# EAGLE design microm_schem2 (EAGLE 9.6.2)
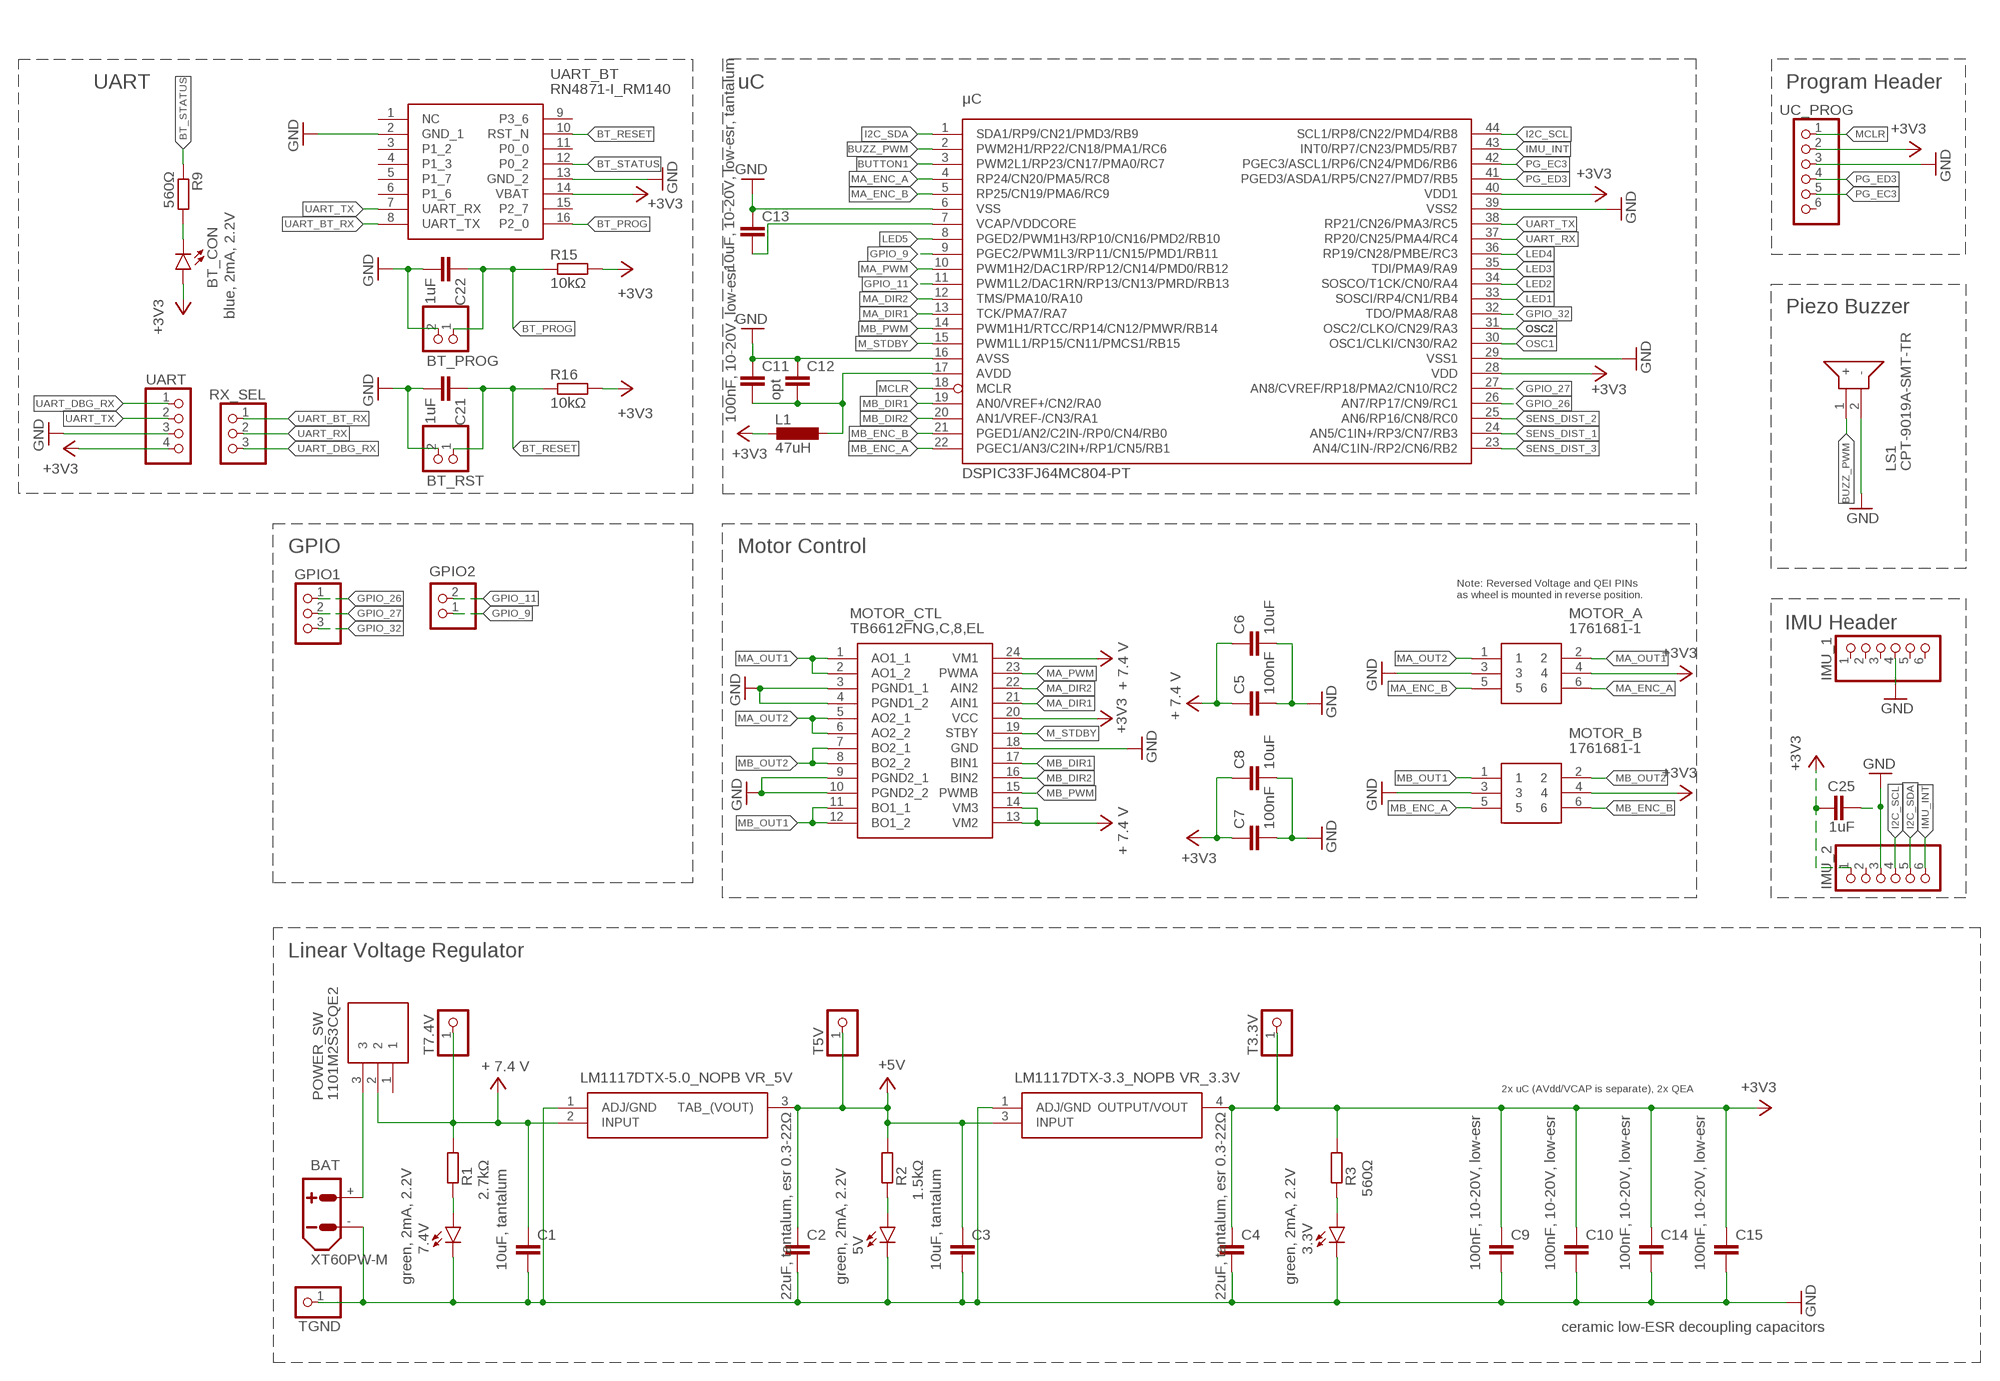
[diagram p0: schematic, sheet 1, part 1 of 2]
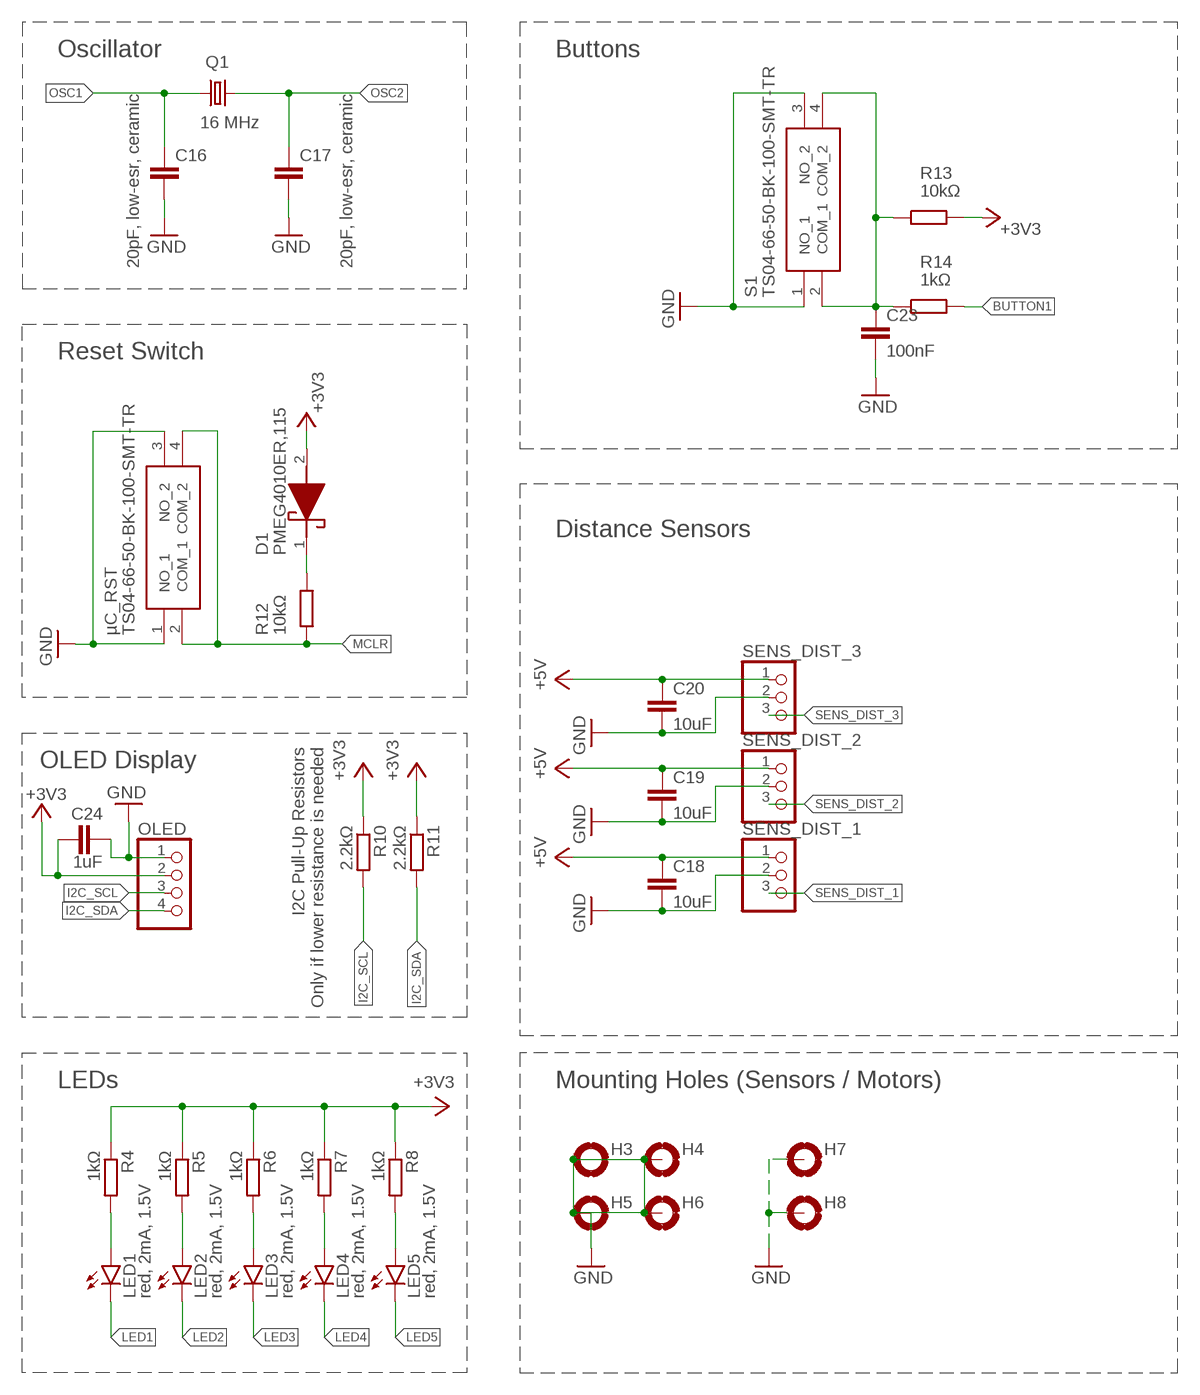
[diagram p1: schematic, sheet 1, part 2 of 2]

## Parts
3.3V  green, 2mA, 2.2V  LEDCHIP-LED0805  [CHIP-LED0805]
5V  green, 2mA, 2.2V  LEDCHIP-LED0805  [CHIP-LED0805]
7.4V  green, 2mA, 2.2V  LEDCHIP-LED0805  [CHIP-LED0805]
BAT  XT60PW-M  [XT60PW-M]
BT_CON  blue, 2mA, 2.2V  LEDCHIP-LED0805  [CHIP-LED0805]
BT_PROG  PINHD-1X2  [1X02]
BT_RST  PINHD-1X2  [1X02]
C1  10uF, tantalum  C-EUC0805  [C0805]
C2  22uF, tantalum, esr 0.3-22Ω  C-EUC0805  [C0805]
C3  10uF, tantalum  C-EUC0805  [C0805]
C4  22uF, tantalum, esr 0.3-22Ω  C-EUC0805  [C0805]
C5  100nF  C-EUC0805  [C0805]
C6  10uF  C-EUC0805  [C0805]
C7  100nF  C-EUC0805  [C0805]
C8  10uF  C-EUC0805  [C0805]
C9  100nF, 10-20V, low-esr  C-EUC0805  [C0805]
C10  100nF, 10-20V, low-esr  C-EUC0805  [C0805]
C11  100nF, 10-20V, low-esr  C-EUC0805  [C0805]
C12  opt  C-EUC0805  [C0805]
C13  10uF, 10-20V, low-esr, tantalum  C-EUC0805  [C0805]
C14  100nF, 10-20V, low-esr  C-EUC0805  [C0805]
C15  100nF, 10-20V, low-esr  C-EUC0805  [C0805]
C16  20pF, low-esr, ceramic  C-EUC0805  [C0805]
C17  20pF, low-esr, ceramic  C-EUC0805  [C0805]
C18  10uF  C-EUC0805  [C0805]
C19  10uF  C-EUC0805  [C0805]
C20  10uF  C-EUC0805  [C0805]
C21  1uF  C-EUC0805  [C0805]
C22  1uF  C-EUC0805  [C0805]
C23  100nF  C-EUC0805  [C0805]
C24  1uF  C-EUC0805  [C0805]
C25  1uF  C-EUC0805  [C0805]
D1  PMEG4010ER,115  [PMEG4010ER115]
GPIO1  PINHD-1X3  [1X03]
GPIO2  PINHD-1X2  [1X02]
H3  MOUNT-PAD-ROUND2.8  [2,8-PAD]
H4  MOUNT-PAD-ROUND2.8  [2,8-PAD]
H5  MOUNT-PAD-ROUND2.8  [2,8-PAD]
H6  MOUNT-PAD-ROUND2.8  [2,8-PAD]
H7  MOUNT-PAD-ROUND2.8  [2,8-PAD]
H8  MOUNT-PAD-ROUND2.8  [2,8-PAD]
IMU_1  PINHD-1X6  [1X06]
IMU_2  PINHD-1X6  [1X06]
L1  47uH  L-EUL1812  [L1812]
LED1  red, 2mA, 1.5V  LEDCHIPLED_0805  [CHIPLED_0805]
LED2  red, 2mA, 1.5V  LEDCHIPLED_0805  [CHIPLED_0805]
LED3  red, 2mA, 1.5V  LEDCHIPLED_0805  [CHIPLED_0805]
LED4  red, 2mA, 1.5V  LEDCHIPLED_0805  [CHIPLED_0805]
LED5  red, 2mA, 1.5V  LEDCHIPLED_0805  [CHIPLED_0805]
LS1  CPT-9019A-SMT-TR  [CPT9019ASMTTR]
MOTOR_A  1761681-1  [SHDR6W67P254_2X3_1524X916X922P]
MOTOR_B  1761681-1  [SHDR6W67P254_2X3_1524X916X922P]
MOTOR_CTL  TB6612FNG,C,8,EL  [SOP65P760X160-24N]
OLED  PINHD-1X4  [1X04]
POWER_SW  1101M2S3CQE2  [1000-SERIES(SPDT)]
Q1  16 MHz  CRYSTALHC49S  [HC49/S]
R1  2.7kΩ  R-EU_R0805  [R0805]
R2  1.5kΩ  R-EU_R0805  [R0805]
R3  560Ω  R-EU_R0805  [R0805]
R4  1kΩ  R-EU_R0805  [R0805]
R5  1kΩ  R-EU_R0805  [R0805]
R6  1kΩ  R-EU_R0805  [R0805]
R7  1kΩ  R-EU_R0805  [R0805]
R8  1kΩ  R-EU_R0805  [R0805]
R9  560Ω  R-EU_R0805  [R0805]
R10  2.2kΩ  R-EU_R0805  [R0805]
R11  2.2kΩ  R-EU_R0805  [R0805]
R12  10kΩ  R-EU_R0805  [R0805]
R13  10kΩ  R-EU_R0805  [R0805]
R14  1kΩ  R-EU_R0805  [R0805]
R15  10kΩ  R-EU_R0805  [R0805]
R16  10kΩ  R-EU_R0805  [R0805]
RX_SEL  PINHD-1X3  [1X03]
S1  TS04-66-50-BK-100-SMT-TR  [TS046650BK100SMTTR]
SENS_DIST_1  PINHD-1X3  [1X03]
SENS_DIST_2  PINHD-1X3  [1X03]
SENS_DIST_3  PINHD-1X3  [1X03]
T3.3V  PINHD-1X1  [1X01]
T5V  PINHD-1X1  [1X01]
T7.4V  PINHD-1X1  [1X01]
TGND  PINHD-1X1  [1X01]
UART  PINHD-1X4  [1X04]
UART_BT  RN4871-I_RM140  [RN4871IRM140]
UC_PROG  PINHD-1X6  [1X06]
VR_3.3V  LM1117DTX-3.3_NOPB  [LM1117DTX33NOPB]
VR_5V  LM1117DTX-5.0_NOPB  [LM78M05CDT]
µC_RST  TS04-66-50-BK-100-SMT-TR  [TS046650BK100SMTTR]
μC  DSPIC33FJ64MC804-PT  [TQFP44]

## Nets
+3V3: BT_CON.A C4.1 C7.1 C8.1 C9.1 C10.1 C14.1 C15.1 C24.1 C25.1 D1.2(A) IMU_2.1 L1.2 MOTOR_A.4 MOTOR_B.4 MOTOR_CTL.20(VCC) OLED.2 R3.1 R4.1 R5.1 R6.1 R7.1 R8.1 R10.1 R11.1 R13.2 R15.2 R16.2 T3.3V.1 UART.4 UART_BT.14(VBAT) UC_PROG.2 VR_3.3V.4(OUTPUT/VOUT) μC.28(VDD) μC.40(VDD1)
+5V: C2.1 C3.1 C18.1 C19.1 C20.1 R2.1 SENS_DIST_1.1 SENS_DIST_2.1 SENS_DIST_3.1 T5V.1 VR_3.3V.3(INPUT) VR_5V.3(TAB_(VOUT))
+7V4: C1.1 C5.1 C6.1 MOTOR_CTL.13(VM2) MOTOR_CTL.14(VM3) MOTOR_CTL.24(VM1) POWER_SW.2 R1.1 T7.4V.1 VR_5V.2(INPUT) ; supply symbol labelled + 7.4 V
BT_PROG: BT_PROG.1 C22.1 R15.1 UART_BT.16(P2_0)
BT_RESET: BT_RST.1 C21.1 R16.1 UART_BT.10(RST_N)
BT_STATUS: R9.1 UART_BT.12(P0_2)
BUTTON1: R14.2 μC.3(PWM2L1/RP23/CN17/PMA0/RC7)
BUZZ_PWM: LS1.1(+) μC.2(PWM2H1/RP22/CN18/PMA1/RC6)
GND: 3.3V.C 5V.C 7.4V.C BAT.- BT_PROG.2 BT_RST.2 C1.2 C2.2 C3.2 C4.2 C5.2 C6.2 C7.2 C8.2 C9.2 C10.2 C11.1 C12.1 C13.1 C14.2 C15.2 C16.2 C17.2 C18.2 C19.2 C20.2 C21.2 C22.2 C23.2 C24.2 C25.2 H3.B2,8(MOUNT) H4.B2,8(MOUNT) H5.B2,8(MOUNT) H6.B2,8(MOUNT) H7.B2,8(MOUNT) H8.B2,8(MOUNT) IMU_1.4 IMU_2.3 LS1.2(-) MOTOR_A.3 MOTOR_B.3 MOTOR_CTL.3(PGND1_1) MOTOR_CTL.4(PGND1_2) MOTOR_CTL.9(PGND2_1) MOTOR_CTL.10(PGND2_2) MOTOR_CTL.18(GND) OLED.1 S1.1(NO_1) S1.3(NO_2) SENS_DIST_1.2 SENS_DIST_2.2 SENS_DIST_3.2 TGND.1 UART.3 UART_BT.2(GND_1) UART_BT.13(GND_2) UC_PROG.3 VR_3.3V.1(ADJ/GND) VR_5V.1(ADJ/GND) µC_RST.1(NO_1) µC_RST.3(NO_2) μC.6(VSS) μC.16(AVSS) μC.29(VSS1) μC.39(VSS2)
GPIO_9: GPIO2.1 μC.9(PGEC2/PWM1L3/RP11/CN15/PMD1/RB11)
GPIO_11: GPIO2.2 μC.11(PWM1L2/DAC1RN/RP13/CN13/PMRD/RB13)
GPIO_26: GPIO1.1 μC.26(AN7/RP17/CN9/RC1)
GPIO_27: GPIO1.2 μC.27(AN8/CVREF/RP18/PMA2/CN10/RC2)
GPIO_32: GPIO1.3 μC.32(TDO/PMA8/RA8)
I2C_SCL: IMU_2.4 OLED.3 R10.2 μC.44(SCL1/RP8/CN22/PMD4/RB8)
I2C_SDA: IMU_2.5 OLED.4 R11.2 μC.1(SDA1/RP9/CN21/PMD3/RB9)
IMU_INT: IMU_2.6 μC.43(INT0/RP7/CN23/PMD5/RB7)
LED1: LED1.C μC.33(SOSCI/RP4/CN1/RB4)
LED2: LED2.C μC.34(SOSCO/T1CK/CN0/RA4)
LED3: LED3.C μC.35(TDI/PMA9/RA9)
LED4: LED4.C μC.36(RP19/CN28/PMBE/RC3)
LED5: LED5.C μC.8(PGED2/PWM1H3/RP10/CN16/PMD2/RB10)
M_STDBY: MOTOR_CTL.19(STBY) μC.15(PWM1L1/RP15/CN11/PMCS1/RB15)
MA_DIR1: MOTOR_CTL.21(AIN1) μC.13(TCK/PMA7/RA7)
MA_DIR2: MOTOR_CTL.22(AIN2) μC.12(TMS/PMA10/RA10)
MA_ENC_A: MOTOR_A.6 μC.4(RP24/CN20/PMA5/RC8)
MA_ENC_B: MOTOR_A.5 μC.5(RP25/CN19/PMA6/RC9)
MA_OUT1: MOTOR_A.2 MOTOR_CTL.1(AO1_1) MOTOR_CTL.2(AO1_2)
MA_OUT2: MOTOR_A.1 MOTOR_CTL.5(AO2_1) MOTOR_CTL.6(AO2_2)
MA_PWM: MOTOR_CTL.23(PWMA) μC.10(PWM1H2/DAC1RP/RP12/CN14/PMD0/RB12)
MB_DIR1: MOTOR_CTL.17(BIN1) μC.19(AN0/VREF+/CN2/RA0)
MB_DIR2: MOTOR_CTL.16(BIN2) μC.20(AN1/VREF-/CN3/RA1)
MB_ENC_A: MOTOR_B.5 μC.22(PGEC1/AN3/C2IN+/RP1/CN5/RB1)
MB_ENC_B: MOTOR_B.6 μC.21(PGED1/AN2/C2IN-/RP0/CN4/RB0)
MB_OUT1: MOTOR_B.1 MOTOR_CTL.11(BO1_1) MOTOR_CTL.12(BO1_2)
MB_OUT2: MOTOR_B.2 MOTOR_CTL.7(BO2_1) MOTOR_CTL.8(BO2_2)
MB_PWM: MOTOR_CTL.15(PWMB) μC.14(PWM1H1/RTCC/RP14/CN12/PMWR/RB14)
MCLR: R12.1 UC_PROG.1 µC_RST.2(COM_1) µC_RST.4(COM_2) μC.18(MCLR)
N$1: BT_CON.C R9.2
N$2: BAT.+ POWER_SW.3
N$3: LED1.A R4.2
N$4: 7.4V.A R1.2
N$5: C11.2 C12.2 L1.1 μC.17(AVDD)
N$6: C23.1 R13.1 R14.1 S1.2(COM_1) S1.4(COM_2)
N$7: D1.1(K) R12.2
N$8: LED2.A R5.2
N$16: 5V.A R2.2
N$17: 3.3V.A R3.2
N$61: LED3.A R6.2
N$62: LED4.A R7.2
N$63: LED5.A R8.2
OSC1: C16.1 Q1.1 μC.30(OSC1/CLKI/CN30/RA2)
OSC2: C17.1 Q1.2 μC.31(OSC2/CLKO/CN29/RA3)
PG_EC3: UC_PROG.5 μC.42(PGEC3/ASCL1/RP6/CN24/PMD6/RB6)
PG_ED3: UC_PROG.4 μC.41(PGED3/ASDA1/RP5/CN27/PMD7/RB5)
SENS_DIST_1: SENS_DIST_1.3 μC.24(AN5/C1IN+/RP3/CN7/RB3)
SENS_DIST_2: SENS_DIST_2.3 μC.25(AN6/RP16/CN8/RC0)
SENS_DIST_3: SENS_DIST_3.3 μC.23(AN4/C1IN-/RP2/CN6/RB2)
UART_BT_RX: RX_SEL.1 UART_BT.8(UART_TX)
UART_DBG_RX: RX_SEL.3 UART.1
UART_RX: RX_SEL.2 μC.37(RP20/CN25/PMA4/RC4)
UART_TX: UART.2 UART_BT.7(UART_RX) μC.38(RP21/CN26/PMA3/RC5)
VCAP/VDDCORE: C13.2 μC.7(VCAP/VDDCORE)
Unconnected: IMU_1.1 IMU_1.2 IMU_1.3 IMU_1.5 IMU_1.6 IMU_2.2 POWER_SW.1 UART_BT.1(NC) UART_BT.3(P1_2) UART_BT.4(P1_3) UART_BT.5(P1_7) UART_BT.6(P1_6) UART_BT.9(P3_6) UART_BT.11(P0_0) UART_BT.15(P2_7) UC_PROG.6

## Notes on the sheet
- UART | uC | Program Header | Oscillator | Buttons
- Piezo Buzzer
- Reset Switch
- Distance Sensors
- GPIO | Motor Control
- Note: Reversed Voltage and QEI PINs 
  as wheel is mounted in reverse position.
- IMU Header
- I2C Pull-Up Resistors
  Only if lower resistance is needed
- OLED Display
- Linear Voltage Regulator | LEDs | Mounting Holes (Sensors / Motors)
- 2x uC (AVdd/VCAP is separate), 2x QEA
- ceramic low-ESR decoupling capacitors

## Library data of the parts
3.3V 5V 7.4V BT_CON LED1-LED5 = led:LED: LED OSRAM: - CHIPLED LG R971, LG N971, LY N971, LG Q971, LY Q971, LO R971, LY R971 LH N974, LH R974 LS Q976, LO Q976, LY Q976 LO Q996 - Hyper CHIPLED LW Q18S LB Q993, LB Q99A, LB R99A - SideLED LS A670, LO A670, LY A670, LG A670, LP A670 LB A673, LV A673, LT A673, LW A673 LH A674 LY A675 LS A676, LA A676, LO A676, LY A676, LW A676 LS A679, LY A679, LG A679 - Hyper Micro SIDELED® LS Y876, LA Y876, LO Y876, LY Y876 LT Y87S - SmartLED LW L88C, LW L88S LB L89C, LB L89S, LG L890 LS L89K, LO L89K, LY L89K LS L896, LA L896, LO L896, LY L896 - TOPLED LS T670, LO T670, LY T670, LG T670, LP T670 LSG T670, LSP T670, LSY T670, LOP T670, LYG T670 LG T671, LOG T671, LSG T671 LB T673, LV T673, LT T673, LW T673 LH T674 LS T676, LA T676, LO T676, LY T676, LB T676, LH T676, LSB T676, LW T676 LB T67C, LV T67C, LT T67C, LS T67K, LO T67K, LY T67K, LW E67C LS E67B, LA E67B, LO E67B, LY E67B, LB E67C, LV E67C, LT E67C LW T67C LS T679, LY T679, LG T679 LS T770, LO T770, LY T770, LG T770, LP T770 LB T773, LV T773, LT T773, LW T773 LH T774 LS E675, LA E675, LY E675, LS T675 LS T776, LA T776, LO T776, LY T776, LB T776 LHGB T686 LT T68C, LB T68C - Hyper Mini TOPLED® LB M676 - Mini TOPLED Santana® LG M470 LS M47K, LO M47K, LY M47K Source: http://www.osram.convergy.de LUXEON: - LUMILED® LXK2-PW12-R00, LXK2-PW12-S00, LXK2-PW14-U00, LXK2-PW14-V00 LXK2-PM12-R00, LXK2-PM12-S00, LXK2-PM14-U00 LXK2-PE12-Q00, LXK2-PE12-R00, LXK2-PE12-S00, LXK2-PE14-T00, LXK2-PE14-U00 LXK2-PB12-K00, LXK2-PB12-L00, LXK2-PB12-M00, LXK2-PB14-N00, LXK2-PB14-P00, LXK2-PB14-Q00 LXK2-PR12-L00, LXK2-PR12-M00, LXK2-PR14-Q00, LXK2-PR14-R00 LXK2-PD12-Q00, LXK2-PD12-R00, LXK2-PD12-S00 LXK2-PH12-R00, LXK2-PH12-S00 LXK2-PL12-P00, LXK2-PL12-Q00, LXK2-PL12-R00 Source: www.luxeon.com KINGBRIGHT: KA-3528ASYC Source: www.kingbright.com
BAT = amass:XT60: AMASS XT60 connector Store in Japan AMASS XT60 connector <https://szc.jp/ams-xt60>
BT_PROG BT_RST GPIO2 = pinhead:PINHD-1X2: PIN HEADER
C1-C25 = rcl:C-EU: CAPACITOR, European symbol; SPICEPREFIX: C
D1 = SamacSys_Parts:PMEG4010ER,115: Nexperia 40V 1A, Diode, 2-Pin SOD-123 PMEG4010ER,115 Source: Datasheet <https://assets.nexperia.com/documents/data-sheet/PMEG4010ER.pdf>; DESCRIPTION: Nexperia 40V 1A, Diode, 2-Pin SOD-123 PMEG4010ER,115; HEIGHT: 1.1mm; MANUFACTURER_NAME: Nexperia; MANUFACTURER_PART_NUMBER: PMEG4010ER,115; MOUSER_PART_NUMBER: 771-PMEG4010ER115; MOUSER_PRICE-STOCK: https://www.mouser.co.uk/ProductDetail/Nexperia/PMEG4010ER115?qs=LMSg3oBIm%2FgUK9jNVC9MaQ%3D%3D
GPIO1 RX_SEL SENS_DIST_1-SENS_DIST_3 = pinhead:PINHD-1X3: PIN HEADER
H3-H8 = holes:MOUNT-PAD-ROUND: MOUNTING PAD, round
IMU_1 IMU_2 UC_PROG = pinhead:PINHD-1X6: PIN HEADER
L1 = rcl:L-EU: INDUCTOR, European symbol; SPICEPREFIX: L
LS1 = SamacSys_Parts:CPT-9019A-SMT-TR: 9 mm, 25 Vp-p Vdc, 75 dB, Surface Mount (SMT), Piezo Audio Transducer Buzzer Source: Datasheet <https://www.sameskydevices.com/product/resource/supplyframepdf/cpt-9019a-smt-tr.pdf>; ARROW_PART_NUMBER: CPT-9019A-SMT-TR; ARROW_PRICE-STOCK: https://www.arrow.com/en/products/cpt-9019a-smt-tr/same-sky-(formerly-cui-devices)?utm_currency=USD&region=nac; DESCRIPTION: 9 mm, 25 Vp-p Vdc, 75 dB, Surface Mount (SMT), Piezo Audio Transducer Buzzer; HEIGHT: 2.1mm; MANUFACTURER_NAME: Same Sky; MANUFACTURER_PART_NUMBER: CPT-9019A-SMT-TR; MOUSER_PART_NUMBER: 179-CPT-9019A-SMT-TR; MOUSER_PRICE-STOCK: https://www.mouser.co.uk/ProductDetail/Same-Sky/CPT-9019A-SMT-TR?qs=3Rah4i%252BhyCH9W9p08uaaRg%3D%3D
MOTOR_A MOTOR_B = SamacSys_Parts:1761681-1: Body Features: Primary Product Color Black | Connector Profile Low | Daisy Chain With | Configuration Features: PCB Mount Orientation Vertical | Number of Positions 6 | Number of Rows 2 | Contact Features: Contact Mating Area Plating Material Thickness 15 MICIN | Contact Type Pin | PCB Contact Termination Area Plating Material Tin | Contact Base Material Phosphor Bronze | PCB Contact Termination Area Plating Material Thickness 100 MICIN | Contact Current Rating (Max) 1 AMP | Contact Underplating Material Ni Source: Datasheet <https://www.te.com/commerce/DocumentDelivery/DDEController?Action=showdoc&DocId=Customer Drawing1761681A1pdfEnglishENG_CD_1761681_A1.pdf1761681-1>; DESCRIPTION: Body Features: Primary Product Color Black | Connector Profile Low | Daisy Chain With | Configuration Features: PCB Mount Orientation Vertical | Number of Positions 6 | Number of Rows 2 | Contact Features: Contact Mating Area Plating Material Thickness 15 MICIN | Contact Type Pin | PCB Contact Termination Area Plating Material Tin | Contact Base Material Phosphor Bronze | PCB Contact Termination Area Plating Material Thickness 100 MICIN | Contact Current Rating (Max) 1 AMP | Contact Underplating Material Ni; HEIGHT: 9.22mm; MANUFACTURER_NAME: TE Connectivity; MANUFACTURER_PART_NUMBER: 1761681-1; MOUSER_PART_NUMBER: 571-1761681-1; MOUSER_PRICE-STOCK: https://www.mouser.co.uk/ProductDetail/TE-Connectivity/1761681-1?qs=BqFpTYCQ3dLAeZ2wzdz7aw%3D%3D
MOTOR_CTL = SamacSys_Parts:TB6612FNG,C,8,EL: otor / Motion / Ignition Controllers & Drivers Brush Motor Driver IC Source: Datasheet <http://toshiba.semicon-storage.com/info/docget.jsp?did=10660&prodName=TB6612FNG>; DESCRIPTION: otor / Motion / Ignition Controllers & Drivers Brush Motor Driver IC; HEIGHT: 1.6mm; MANUFACTURER_NAME: Toshiba; MANUFACTURER_PART_NUMBER: TB6612FNG,C,8,EL; MOUSER_PART_NUMBER: 757-TB6612FNGC8EL; MOUSER_PRICE-STOCK: https://www.mouser.co.uk/ProductDetail/Toshiba/TB6612FNGC8EL?qs=rsevcuukUAy2UalRuv4E%2FQ%3D%3D
OLED UART = pinhead:PINHD-1X4: PIN HEADER
POWER_SW = SamacSys_Parts:1101M2S3CQE2: 1101M2S3CQE2 (Slide Switches) Source: Datasheet <https://www.ckswitches.com/media/1429/1000.pdf>; ARROW_PART_NUMBER: 1101M2S3CQE2; ARROW_PRICE-STOCK: https://www.arrow.com/en/products/1101m2s3cqe2/ck?utm_currency=USD&region=europe; DESCRIPTION: 1101M2S3CQE2 (Slide Switches); HEIGHT: mm; MANUFACTURER_NAME: C & K COMPONENTS; MANUFACTURER_PART_NUMBER: 1101M2S3CQE2; MOUSER_PART_NUMBER: 611-1101M2S3CQE2; MOUSER_PRICE-STOCK: https://www.mouser.co.uk/ProductDetail/CK/1101M2S3CQE2?qs=C4UUOezh8MStnZqkTHGAfQ%3D%3D
Q1 = crystal:CRYSTAL: CRYSTAL; OC_FARNELL: 1667008; OC_NEWARK: unknown
R1-R16 = rcl:R-EU_: RESISTOR, European symbol; SPICEPREFIX: R
S1 µC_RST = SamacSys_Parts:TS04-66-50-BK-100-SMT-TR: 6 x 6 mm, 9.5 mm Actuator Height, 160 gf, Black, Surface Mount, SPST, Tactile Switch Source: Datasheet <https://www.sameskydevices.com/product/resource/supplyframepdf/ts04.pdf>; DESCRIPTION: 6 x 6 mm, 5 mm Actuator Height, 160 gf, Black, Surface Mount, SPST, Tactile Switch; HEIGHT: 5mm; MANUFACTURER_NAME: Same Sky; MANUFACTURER_PART_NUMBER: TS04-66-95-BK-160-SMT-TR; MOUSER_PART_NUMBER: 179-TS046695BK160SMR; MOUSER_PRICE-STOCK: https://www.mouser.co.uk/ProductDetail/Same-Sky/TS04-66-95-BK-160-SMT-TR?qs=VJzv269c%252BPZ4T0IrjAQJjg%3D%3D
T3.3V T5V T7.4V TGND = pinhead:PINHD-1X1: PIN HEADER
UART_BT = SamacSys_Parts:RN4871-I_RM140: Bluetooth Modules (802.15.1) Bluetooth Low Energy BLE Module, Shielded, Antenna, ASCII Interface, 9x11.5mm Source: Datasheet <https://ww1.microchip.com/downloads/aemDocuments/documents/WSG/ProductDocuments/DataSheets/RN4870-71-Bluetooth-Low-Energy-Module-DS50002489.pdf>; ARROW_PART_NUMBER: RN4871-I/RM140; ARROW_PRICE-STOCK: https://www.arrow.com/en/products/rn4871-irm140/microchip-technology?utm_currency=USD&region=nac; DESCRIPTION: Bluetooth Modules (802.15.1) Bluetooth Low Energy BLE Module, Shielded, Antenna, ASCII Interface, 9x11.5mm; HEIGHT: 2.1mm; MANUFACTURER_NAME: Microchip; MANUFACTURER_PART_NUMBER: RN4871-I/RM140; MOUSER_PART_NUMBER: 579-RN4871-I/RM140; MOUSER_PRICE-STOCK: https://www.mouser.co.uk/ProductDetail/Microchip-Technology/RN4871-I-RM140?qs=BJlw7L4Cy79OHrwBC2yoPQ%3D%3D
VR_3.3V = SamacSys_Parts:LM1117DTX-3.3_NOPB: Space saving 800-mA low-dropout linear regulator with internal current limit Source: Datasheet <http://www.ti.com/lit/gpn/lm1117>; ARROW_PART_NUMBER: LM1117DTX-3.3/NOPB; ARROW_PRICE-STOCK: https://www.arrow.com/en/products/lm1117dtx-3.3nopb/texas-instruments?utm_currency=USD&region=nac; DESCRIPTION: Space saving 800-mA low-dropout linear regulator with internal current limit; HEIGHT: mm; MANUFACTURER_NAME: Texas Instruments; MANUFACTURER_PART_NUMBER: LM1117DTX-3.3/NOPB; MOUSER_PART_NUMBER: 926-LM1117DTX3.3NOPB; MOUSER_PRICE-STOCK: https://www.mouser.co.uk/ProductDetail/Texas-Instruments/LM1117DTX-3.3-NOPB?qs=X1J7HmVL2ZFMDtR97FJi7A%3D%3D
VR_5V = SamacSys_Parts:LM1117DTX-5.0_NOPB: Space saving 800-mA low-dropout linear regulator with internal current limit Source: Datasheet <http://www.ti.com/lit/gpn/lm1117>; ARROW_PART_NUMBER: LM1117DTX-5.0/NOPB; ARROW_PRICE-STOCK: https://www.arrow.com/en/products/lm1117dtx-5.0nopb/texas-instruments?utm_currency=USD&region=nac; DESCRIPTION: Space saving 800-mA low-dropout linear regulator with internal current limit; HEIGHT: mm; MANUFACTURER_NAME: Texas Instruments; MANUFACTURER_PART_NUMBER: LM1117DTX-5.0/NOPB; MOUSER_PART_NUMBER: 926-LM1117DTX50NOPB; MOUSER_PRICE-STOCK: https://www.mouser.co.uk/ProductDetail/Texas-Instruments/LM1117DTX-5.0-NOPB?qs=X1J7HmVL2ZGetRa19U64lA%3D%3D
μC = microchip-dspic33fjxxmc:DSPIC33FJ64MC804: dsPIC33FJ32MC302/304, dsPIC33FJ64MCX02/X04, AND dsPIC33FJ128MCX02/X04 High-Performance, 16-bit Digital Signal Controllers Package:44 Pin TQFP Operating Range: * Up to 40 MIPS operation (at 3.0V -3.6V): - Industrial temperature range (-40°C to +85°C) - Extended temperature range (-40°C to +125°C) High-Performance DSC CPU: * Modified Harvard architecture * C compiler optimized instruction set * 16-bit wide data path * 24-bit wide instructions * Linear program memory addressing up to 4M instruction words * Linear data memory addressing up to 64 Kbytes * 83 base instructions: mostly 1 word/1 cycle * Two 40-bit accumulators with rounding and saturation options * Flexible and powerful addressing modes: - Indirect - Modulo - Bit-Reversed * Software stack * 16 x 16 fractional/integer multiply operations * 32/16 and 16/16 divide operations * Single-cycle multiply and accumulate: - Accumulator write back for DSP operations - Dual data fetch * Up to ±16-bit shifts for up to 40-bit data Direct Memory Access (DMA): * 8-channel hardware DMA * Up to 2 Kbytes dual ported DMA buffer area (DMA RAM) to store data transferred via DMA: - Allows data transfer between RAM and a peripheral while CPU is executing code (no cycle stealing) * Most peripherals support DMA Timers/Capture/Compare/PWM: * Timer/Counters, up to five 16-bit timers: - Can pair up to make two 32-bit timers - One timer runs as a Real-Time Clock with an external 32.768 kHz oscillator - Programmable prescaler * Input Capture (up to four channels): - Capture on up, down or both edges - 16-bit capture input functions - 4-deep FIFO on each capture * Output Compare (up to four channels): - Single or Dual 16-bit Compare mode - 16-bit Glitchless PWM mode * Hardware Real-Time Clock/Calendar (RTCC): - Provides clock, calendar, and alarm functions Interrupt Controller: * 5-cycle latency * Up to 53 available interrupt sources * Up to three external interrupts * Seven programmable priority levels * Five processor exceptions Digital I/O: * Peripheral pin Select functionality * Up to 35 programmable digital I/O pins * Wake-up/Interrupt-on-Change for up to 31 pins * Output pins can drive from 3.0V to 3.6V * Up to 5V output with open drain configuration * All digital input pins are 5V tolerant * 4 mA sink on all I/O pins On-Chip Flash and SRAM: * Flash program memory (up to 128 Kbytes) * Data SRAM (up to 16 Kbytes) * Boot, Secure, and General Security for program Flash System Management: * Flexible clock options: - External, crystal, resonator, internal RC - Fully integrated Phase-Locked Loop (PLL) - Extremely low jitter PLL * Power-up Timer * Oscillator Start-up Timer/Stabilizer * Watchdog Timer with its own RC oscillator * Fail-Safe Clock Monitor * Reset by multiple sources Power Management: * On-chip 2.5V voltage regulator * Switch between clock sources in real time * Idle, Sleep, and Doze modes with fast wake-up Analog-to-Digital Converters (ADCs): * 10-bit, 1.1 Msps or 12-bit, 500 Ksps conversion: - Two and four simultaneous samples (10-bit ADC) - Up to nine input channels with auto-scanning - Conversion start can be manual or synchronized with one of four trigger sources - Conversion possible in Sleep mode - ±2 LSb max integral nonlinearity - ±1 LSb max differential nonlinearity Audio Digital-to-Analog Converter (DAC): - 16-bit Dual Channel DAC module - 100 Ksps maximum sampling rate - Second-Order Digital Delta-Sigma Modulator Comparator Module: * Two analog comparators with programmable input/output configuration CMOS Flash Technology: * Low-power, high-speed Flash technology * Fully static design * 3.3V (±10%) operating voltage * Industrial and Extended temperature * Low power consumption Motor Control Peripherals: * 6-channel 16-bit Motor Control PWM: - Three duty cycle generators - Independent or Complementary mode - Programmable dead-time and output polarity - Edge-aligned or center-aligned - Manual output override control - One Fault input - Trigger for ADC conversions - PWM frequency for 16-bit resolution (@ 40 MIPS) = 1220 Hz for Edge-Aligned mode, 610 Hz for Center-Aligned mode - PWM frequency for 11-bit resolution (@ 40 MIPS) = 39.1 kHz for Edge-Aligned mode, 19.55 kHz for Center-Aligned mode * 2-channel 16-bit Motor Control PWM: - One duty cycle generator - Independent or Complementary mode - Programmable dead time and output polarity - Edge-aligned or center-aligned - Manual output override control - One Fault input - Trigger for ADC conversions - PWM frequency for 16-bit resolution (@ 40 MIPS) = 1220 Hz for Edge-Aligned mode, 610 Hz for Center-Aligned mode - PWM frequency for 11-bit resolution (@ 40 MIPS) = 39.1 kHz for Edge-Aligned mode, 19.55 kHz for Center-Aligned mode * 2-Quadrature Encoder Interface module: - Phase A, Phase B, and index pulse input - 16-bit up/down position counter - Count direction status - Position Measurement (x2 and x4) mode - Programmable digital noise filters on inputs - Alternate 16-bit Timer/Counter mode - Interrupt on position counter rollover/underflow

## Board
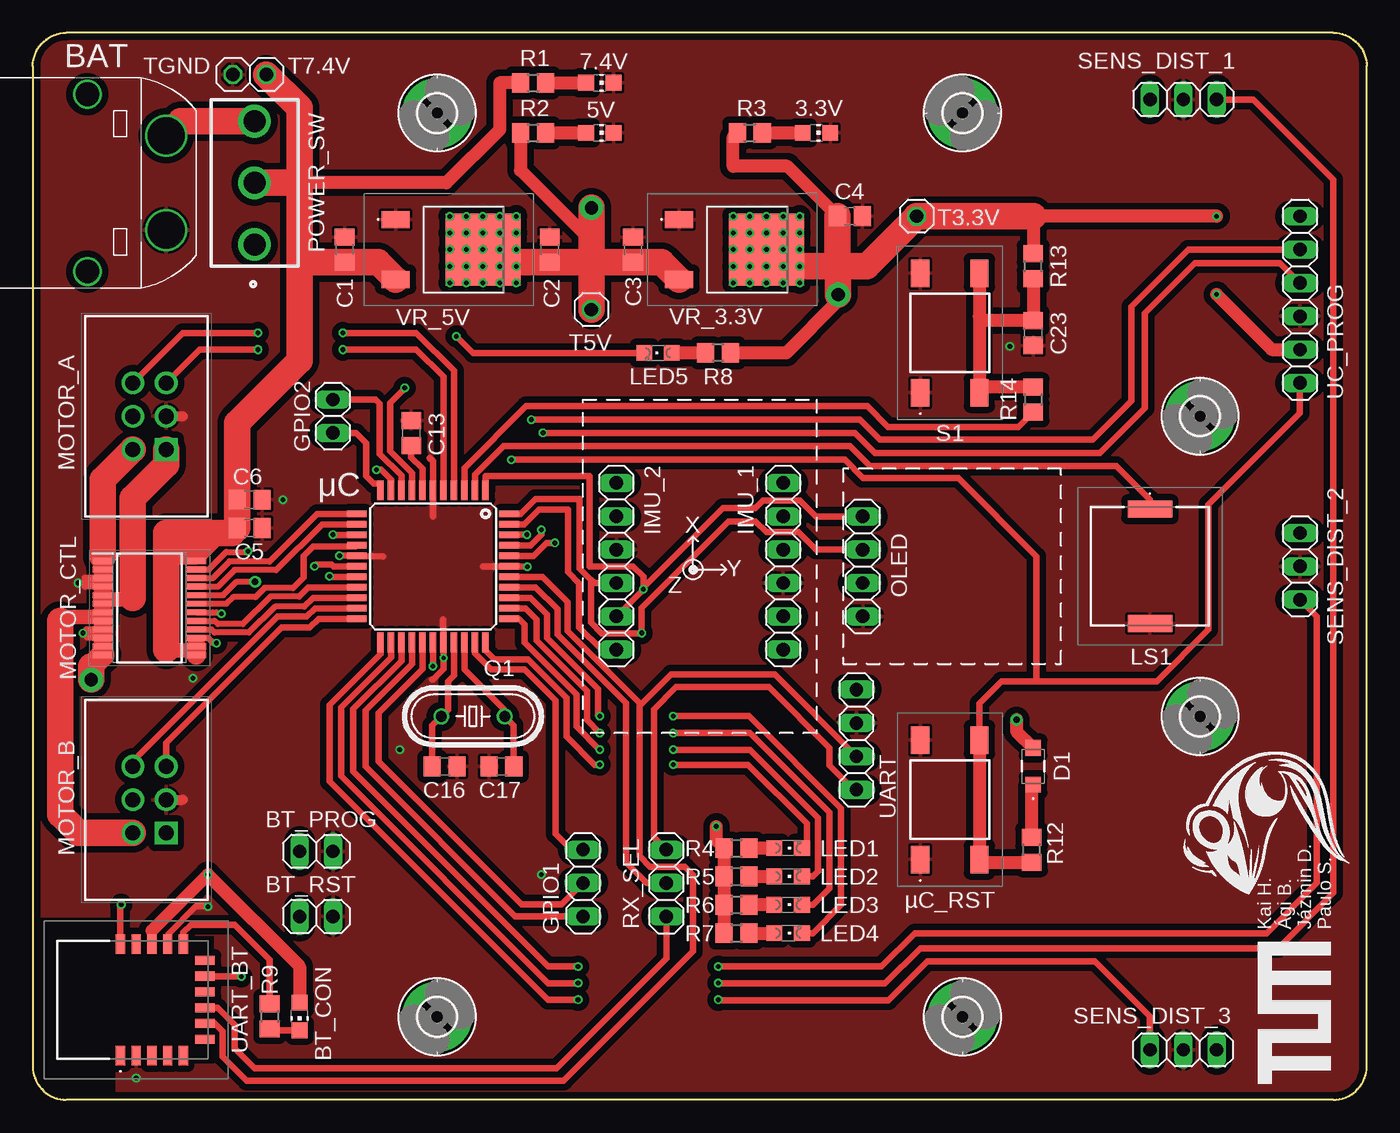
[diagram p2: board, top side]
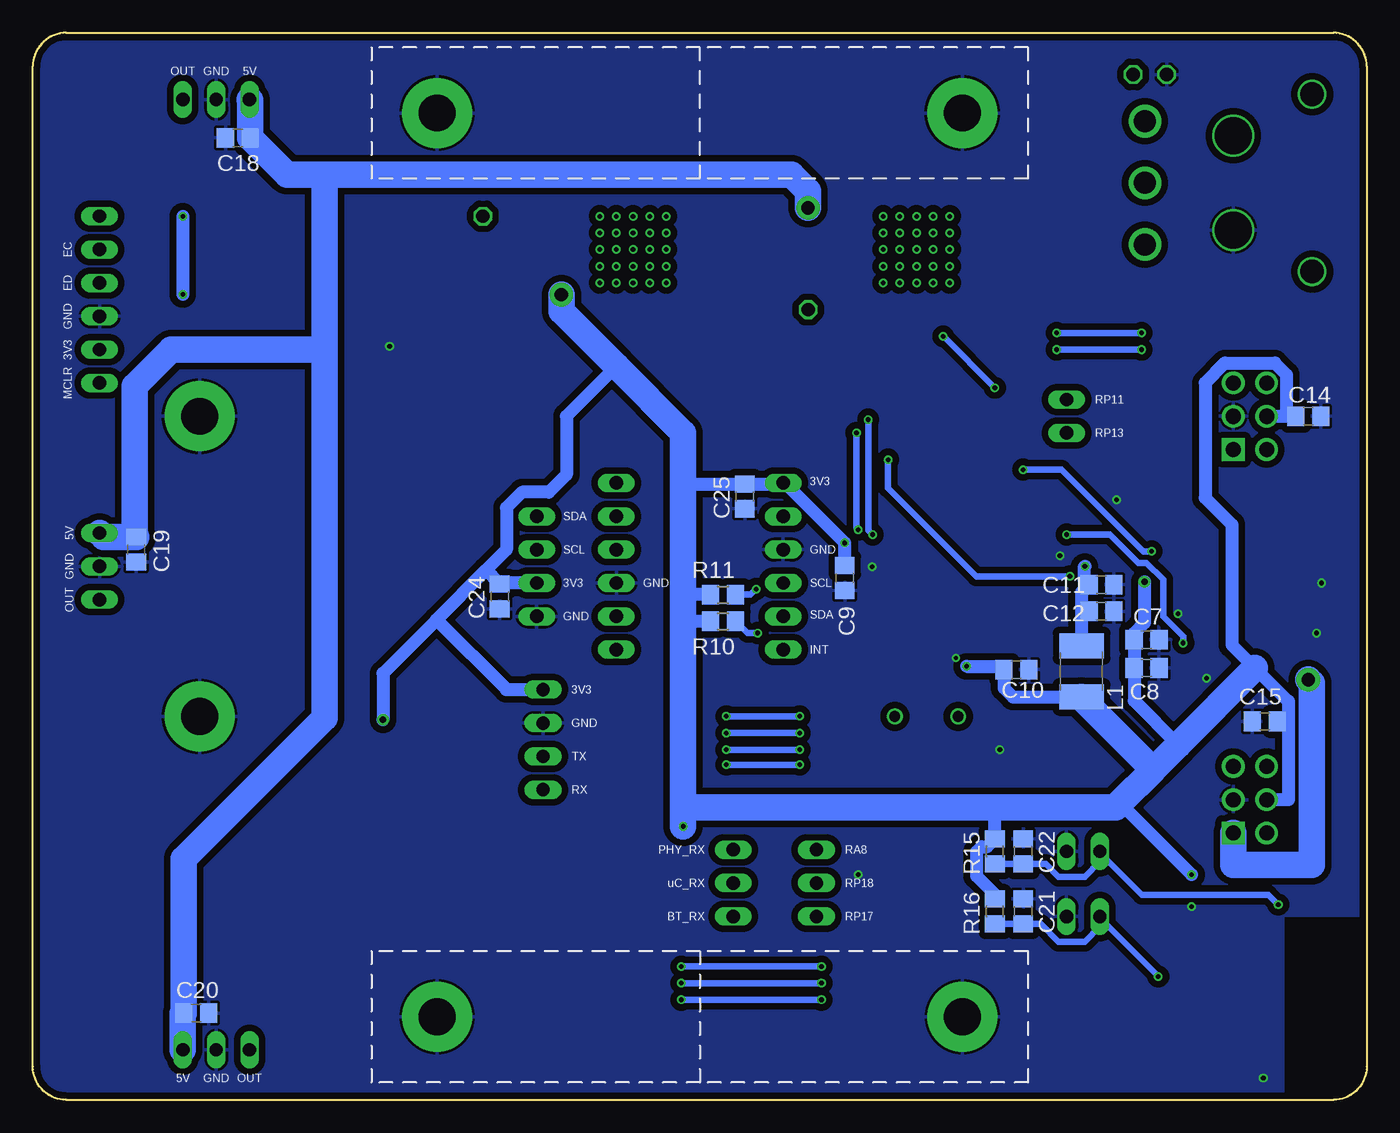
[diagram p3: board, bottom side, seen from below]

Size 101.6 x 81.28 mm. Coordinates in mm from the lower left corner, seen from the top.
Outline: 99.06,0 2.54,0 arc-90 0,2.54 0,78.74 arc-90 2.54,81.28 99.06,81.28 arc-90 101.6,78.74 101.6,2.54 arc-90 99.06,0
Copper layers (1*16): Top 0.035mm / dielectric 1.5mm / Bottom 0.035mm
Design rules "PCB-POOL Standard": minimum track width 0.125mm, minimum drill 0.2mm, track to track 0.125mm, track to pad 0.125mm, pad to pad 0.125mm, via to via 0.125mm, smd to smd 0.125mm, copper to edge 0.3mm, drill to drill 0.2mm, minimum pad ring 0.2mm, minimum via ring 0.15mm, stop-mask expansion 0.03mm, vias tented up to drill 0mil, thermal gap 0.2mm

### Footprints (pad centres in the part's own frame; a part is rotated, then mirrored left to right if it is on the bottom)
CHIP-LED0805 = smd 1.2 x 1.2: A 0,-1.05; C 0,1.05
XT60PW-M = drill 2.8: + 3.6,0; - -3.6,0 | drill 1.8: P$3 -6.75,6; P$4 6.75,6
1X02 = drill 1.016 long: 1 -1.27,0; 2 1.27,0
C0805 = smd 1.3 x 1.5: 1 -0.95,0; 2 0.95,0
PMEG4010ER115 = smd 1.2 x 1.2: 1 -1.4,0; 2 1.4,0
1X03 = drill 1.016 long: 1 -2.54,0; 2 0,0; 3 2.54,0
2,8-PAD = drill 2.8 pad 5.334: B2,8 0,0
1X06 = drill 1.016 long: 1 -6.35,0; 2 -3.81,0; 3 -1.27,0; 4 1.27,0; 5 3.81,0; 6 6.35,0
L1812 = smd 1.9 x 3.4: 1 -1.95,0; 2 1.95,0
CHIPLED_0805 = smd 1.2 x 1.2: A 0,-1.05; C 0,1.05
CPT9019ASMTTR = smd 1.3 x 3.4: 1 -4.35,0; 2 4.35,0
SHDR6W67P254_2X3_1524X916X922P = drill 1.15 pad 1.725 square: 1 0,0 | drill 1.15 pad 1.725: 2 0,2.54; 3 2.54,0; 4 2.54,2.54; 5 5.08,0; 6 5.08,2.54
SOP65P760X160-24N = smd 1.525 x 0.45: 1 -3.562,3.575; 2 -3.562,2.925; 3 -3.562,2.275; 4 -3.562,1.625; 5 -3.562,0.975; 6 -3.562,0.325; 7 -3.562,-0.325; 8 -3.562,-0.975; 9 -3.562,-1.625; 10 -3.562,-2.275; 11 -3.562,-2.925; 12 -3.562,-3.575; 13 3.562,-3.575; 14 3.562,-2.925; 15 3.562,-2.275; 16 3.562,-1.625; 17 3.562,-0.975; 18 3.562,-0.325; 19 3.562,0.325; 20 3.562,0.975; 21 3.562,1.625; 22 3.562,2.275; 23 3.562,2.925; 24 3.562,3.575
1X04 = drill 1.016 long: 1 -3.81,0; 2 -1.27,0; 3 1.27,0; 4 3.81,0
1000-SERIES(SPDT) = drill 1.68 pad 2.48: 1 0,-4.7; 2 0,0; 3 0,4.7
HC49/S = drill 0.813: 1 -2.413,0; 2 2.413,0
R0805 = smd 1.3 x 1.5: 1 -0.95,0; 2 0.95,0
TS046650BK100SMTTR = smd 2.1 x 1.4: 1 -4.55,2.25; 2 -4.55,-2.25; 3 4.55,2.25; 4 4.55,-2.25
1X01 = drill 1.016 octagon: 1 0,0
RN4871IRM140 = smd 1.5 x 0.7: 1 -4.25,0.95; 2 -4.25,-0.25; 3 -4.25,-1.45; 4 -4.25,-2.65; 5 -4.25,-3.85; 12 4.25,-3.85; 13 4.25,-2.65; 14 4.25,-1.45; 15 4.25,-0.25; 16 4.25,0.95 | smd 0.7 x 1.5: 6 -3,-5.5; 7 -1.8,-5.5; 8 -0.6,-5.5; 9 0.6,-5.5; 10 1.8,-5.5; 11 3,-5.5
LM1117DTX33NOPB = smd 2.15 x 1.3: 1 -4.122,2.285; 3 -4.122,-2.285 | smd 5.7 x 5.5: 4 2.543,0
LM78M05CDT = smd 2.15 x 1.3: 1 -4.122,2.285; 2 -4.122,-2.285 | smd 5.7 x 5.5: 3 2.543,0
TQFP44 = smd 1.5 x 0.5: 1 -5.8,4; 2 -5.8,3.2; 3 -5.8,2.4; 4 -5.8,1.6; 5 -5.8,0.8; 6 -5.8,0; 7 -5.8,-0.8; 8 -5.8,-1.6; 9 -5.8,-2.4; 10 -5.8,-3.2; 11 -5.8,-4; 23 5.8,-4; 24 5.8,-3.2; 25 5.8,-2.4; 26 5.8,-1.6; 27 5.8,-0.8; 28 5.8,0; 29 5.8,0.8; 30 5.8,1.6; 31 5.8,2.4; 32 5.8,3.2; 33 5.8,4 | smd 0.5 x 1.5: 12 -4,-5.8; 13 -3.2,-5.8; 14 -2.4,-5.8; 15 -1.6,-5.8; 16 -0.8,-5.8; 17 0,-5.8; 18 0.8,-5.8; 19 1.6,-5.8; 20 2.4,-5.8; 21 3.2,-5.8; 22 4,-5.8; 34 4,5.8; 35 3.2,5.8; 36 2.4,5.8; 37 1.6,5.8; 38 0.8,5.8; 39 0,5.8; 40 -0.8,5.8; 41 -1.6,5.8; 42 -2.4,5.8; 43 -3.2,5.8; 44 -4,5.8

### Placement (x,y rotation side)
3.3V  59.69,73.66 270 top
5V  43.18,73.66 270 top
7.4V  43.18,77.47 270 top
BAT  10.16,69.85 90 top
BT_CON  20.32,6.35 180 top
BT_PROG  21.59,18.92 0 top
BT_RST  21.59,13.97 0 top
C1  23.75,64.77 90 top
C2  39.37,64.77 90 top
C3  45.72,64.77 90 top
C4  62.23,67.31 0 top
C5  16.51,43.56 0 top
C6  16.51,45.72 0 top
C7  16.76,35.05 0 bottom
C8  16.76,32.89 0 bottom
C9  39.75,39.75 270 bottom
C10  26.67,32.77 0 bottom
C11  20.19,39.24 180 bottom
C12  20.19,37.21 180 bottom
C13  28.83,50.8 270 top
C14  4.45,52.07 0 bottom
C15  7.75,28.83 180 bottom
C16  31.37,25.4 0 top
C17  35.69,25.4 180 top
C18  85.98,73.28 180 bottom
C19  93.73,41.91 270 bottom
C20  89.15,6.6 0 bottom
C21  26.16,14.35 90 bottom
C22  26.16,18.92 90 bottom
C23  76.2,58.42 270 top
C24  66.04,38.35 270 bottom
C25  47.37,45.97 270 bottom
D1  76.2,25.4 90 top
GPIO1  41.91,16.51 90 top
GPIO2  22.86,52.07 270 top
H3  30.8,75.17 0 top
H4  70.8,75.17 90 top
H5  30.8,6.33 0 top
H6  70.8,6.33 0 top
H7  88.9,52.07 0 top
H8  88.9,29.21 0 top
IMU_1  57.15,40.64 270 top
IMU_2  44.45,40.64 270 top
L1  21.72,32.64 270 bottom
LED1  57.53,19.18 270 top
LED2  57.53,17.02 270 top
LED3  57.53,14.86 270 top
LED4  57.53,12.7 270 top
LED5  47.62,56.9 90 top
LS1  85.09,40.64 270 top
MOTOR_A  10.16,49.53 90 top
MOTOR_B  10.16,20.32 90 top
MOTOR_CTL  8.89,37.47 0 top
OLED  63.22,40.64 90 top
POWER_SW  16.89,69.85 0 top
Q1  33.53,29.21 0 top
R1  38.1,77.47 0 top
R2  38.1,73.66 0 top
R3  54.61,73.66 0 top
R4  53.59,19.18 0 top
R5  53.59,17.02 0 top
R6  53.59,14.86 0 top
R7  53.59,12.7 0 top
R8  52.2,56.9 180 top
R9  18.03,6.35 270 top
R10  49.02,36.45 0 bottom
R11  49.02,38.48 0 bottom
R12  76.07,19.05 90 top
R13  76.2,63.5 90 top
R14  76.2,53.34 270 top
R15  28.32,18.92 90 bottom
R16  28.32,14.35 90 bottom
RX_SEL  48.26,16.51 90 top
S1  69.85,58.42 90 top
SENS_DIST_1  87.63,76.2 0 top
SENS_DIST_2  96.52,40.64 270 top
SENS_DIST_3  87.63,3.81 180 top
T3.3V  67.31,67.31 0 top
T5V  42.55,60.2 0 top
T7.4V  17.78,78.11 0 top
TGND  15.24,78.11 0 top
UART  62.74,27.43 90 top
UART_BT  7.62,7.62 90 top
UC_PROG  96.52,60.96 90 top
VR_3.3V  53.34,64.77 0 top
VR_5V  31.75,64.77 0 top
µC_RST  69.85,22.86 90 top
μC  30.48,40.64 270 top

### Tracks (layer width: path | path; a pad name or v marks a point on that pad's centre or on a via)
+3V3  (via drill 0.35, 0.5, 1)
  Top 0.45: MOTOR_CTL.20 14.5,38.44 15.53,39.47 v16.92,39.47
  Top 0.5: T3.3V.1 67.56,67.32
  Top 0.508: μC.40 38.14,41.44 39.12,42.42 v39.75,42.42 | μC.28 v30.48,33.02
  Top 0.7: 9.07,12.88 UART_BT.14
  Top 1: 61.28,63.82 60.96,63.5 61.34,63.12 | C4.1 57.47,71.12 53.34,71.12 53.34,73.34 R3.1 | v74.93,28.96 74.93,28.07 D1.2 | 9.07,12.88 v13.34,17.14 20.32,10.16 BT_CON.A | v90.17,67.31 v90.16,67.32 76.2,67.32 R13.2 | v90.17,61.34 94.36,57.15 UC_PROG.2 | R7.1 R6.1 R5.1 R4.1 52.07,19.75 v52.07,20.83 | v61.34,61.34 61.34,60.83 57.4,56.9 R8.1
  Top 2: VR_3.3V.4 57.15,63.5 60.96,63.5 63.54,63.5 67.36,67.32 67.56,67.32 | C4.1 61.28,63.82 | T3.3V.1 67.55,67.31 67.56,67.32 | 67.56,67.32 76.2,67.32 | 61.34,63.12 v61.34,61.34
  Bottom 1: 6.11,52.07 6.11,55.24 6.99,56.12 10.79,56.12 12.3,54.61 12.3,45.85 10.27,43.81 10.27,34.65 8.51,32.89 5.97,30.35 5.97,28.83 | MOTOR_B.4 5.97,22.86 5.97,28.45 | C15.1 6.35,28.83 | 6.35,28.83 5.97,28.83 | C14.1 6.11,52.07 | MOTOR_A.4 6.11,52.07 | 6.35,28.83 5.97,28.45 | 5.97,28.83 5.97,28.45 | C9.1 v39.75,42.42 44.32,46.99 | v30.48,33.02 27.87,33.02 C10.1 27.62,31.37 26.94,30.69 L1.2 | R10.1 52.07,36.45 | 57.15,55.88 60.96,52.07 60.96,47.62 62.29,46.29 64.33,46.29 65.52,45.1 65.52,41.91 67.08,40.35 | R11.1 52.07,38.48 | v90.17,67.31 v90.17,61.34 | R16.2 28.32,15.65 29.72,17.05 29.72,18.89 29.34,19.27 28.92,19.27 R15.2 28.32,22.29 | v13.34,17.14 18.8,22.61 | v16.92,39.47 16.92,36.35 17.71,35.56 C7.1 C8.1 17.71,30.41 14.35,27.05 | 67.08,40.35 70.86,36.57 | OLED.2 65.97,39.37 C24.1 67.08,40.35 | 70.86,36.57 74.93,32.5 v74.93,28.96 | 70.86,36.57 65.53,31.24 UART.4 | 52.07,46.99 52,46.92 C25.1 44.39,46.92 44.32,46.99 | 44.32,46.99 IMU_2.1
  Bottom 2: 52.07,22.29 52.07,36.45 52.07,38.48 52.07,46.99 52.07,50.8 57.15,55.88 61.34,60.07 v61.34,61.34 | 16.26,25.15 18.8,22.61 19.12,22.29 28.32,22.29 52.07,22.29 | 16.26,25.15 14.35,27.05 8.51,32.89 | 52.07,22.29 v52.07,20.83 | 16.26,25.15 21.72,30.61 L1.2
+5V  (via drill 1)
  Top 0.5: VR_5V.3 35.82,64.77 36.77,63.82
  Top 1: R2.1 37.15,70.8 42.55,65.41 42.55,63.82
  Top 2: 36.77,63.82 C2.1 42.55,63.82 | 42.55,63.82 C3.1 47.88,63.82 VR_3.3V.3 | 42.55,63.82 T5V.1 | v42.55,67.94 42.55,63.82
  Bottom 2: 79.38,57.15 91.06,57.15 93.84,54.37 93.84,42.98 C19.1 96.2,42.86 SENS_DIST_2.1 | 79.38,57.15 79.38,29.07 90.1,18.35 C20.1 90.17,6.6 SENS_DIST_3.1 | v42.55,67.94 42.55,69.22 43.81,70.48 79.38,70.48 | 79.38,57.15 79.38,70.48 | 79.38,70.48 82.23,70.48 C18.1 85.03,76.14 SENS_DIST_1.1
+7V4
  Top 0.45: MOTOR_CTL.14 10.41,34.54 | 10.41,34.54 10.16,34.29 10.56,33.89 MOTOR_CTL.13 12.2,34.14 10.81,34.14 10.41,34.54
  Top 0.5: 12.7,43.18 12.45,42.93 12.45,41.78 MOTOR_CTL.24 12.43,41.02 10.16,41.02
  Top 1: R1.1 35.56,77.47 35.56,73.91 31.5,69.85 20.32,69.85
  Top 1.5: MOTOR_CTL.13 arc0 MOTOR_CTL.14
  Top 1.7: 13.97,43.18 12.57,41.78 12.45,41.78 12.2,42.04 10.16,42.04
  Top 2: T7.4V.1 20.32,75.56 20.32,69.85 | 20.32,69.85 POWER_SW.2 | 20.32,63.5 20.32,56.31 15.56,51.55 C6.1 C5.1 15.18,43.18 13.97,43.18 12.7,43.18 10.16,43.18 10.16,42.04 10.16,41.02 10.16,34.29 | 20.32,63.5 20.32,69.85 | 20.32,63.5 20.64,63.82 C1.1 26.29,63.82 VR_5V.2
BT_PROG  (via drill 0.35)
  Top 0.5: UART_BT.16 6.67,14.86 v6.73,14.86
  Bottom 0.5: v6.73,14.86 7.49,15.62 17.14,15.62 20.32,18.8 BT_PROG.1 20.32,18.16 21.48,17 23.47,17 24.45,17.97 C22.1 R15.1
BT_RESET  (via drill 0.35)
  Top 0.5: UART_BT.10 15.85,9.42 v15.88,9.4
  Bottom 0.5: v15.88,9.4 20.32,13.84 BT_RST.1 20.32,13.21 21.48,12.04 23.47,12.04 24.83,13.4 C21.1 R16.1
BT_STATUS
  Top 0.5: UART_BT.12 11.47,12.74 12.06,13.34 15.37,13.34 18.03,10.67 R9.1
BUTTON1
  Top 0.5: μC.3 32.88,48.13 37.58,52.83 63.57,52.83 65.15,51.25 75.06,51.25 R14.2
BUZZ_PWM
  Top 0.5: μC.2 33.68,47.62 35.84,49.78 62.23,49.78 63.75,48.26 82.55,48.26 85.09,45.72 LS1.1
GND  (via drill 0.3, 0.35)
  Top 0.45: MOTOR_CTL.18 13.72,37.14 13.97,37.14 v14.37,37.03 | MOTOR_CTL.10 4.18,35.19 4.13,35.24 | 4.13,35.24 v3.81,35.56 4.09,35.84 MOTOR_CTL.9 4.72,35.84 4.13,35.24 | 3.95,39.74 MOTOR_CTL.3 4.96,39.37 3.94,39.37 | 3.95,39.74 3.94,39.75 | MOTOR_CTL.4 3.96,39.09 3.94,39.12 3.94,39.37 | 3.94,39.37 3.94,39.73 3.95,39.74
  Top 0.5: 30.48,44.45 μC.6 30.48,48.64 30.23,48.9 | 31.24,36.58 μC.29 31.28,32.81 30.48,32 30.41,32 | 34.29,40.64 μC.39 v37.68,40.62 | 26.67,41.4 μC.16 v23.37,41.46 | UART_BT.13 10.34,11.94 10.34,12.66 12.41,14.73 v13.34,14.73
  Top 0.75: MOTOR_A.3 11.43,52.07 | MOTOR_B.3 11.43,22.86
  Top 1.5: MOTOR_CTL.10 arc0 MOTOR_CTL.9 | MOTOR_CTL.4 arc0 MOTOR_CTL.3
  other vias: 7.87,1.65 12.19,32.13 74.42,57.4 27.94,26.67 38.73,17.14 31.29,33.65 19.05,45.72 3.43,39.37
  pour Bottom (isolate 0.5): 2.54,81.28 arc90 0,78.74 0,13.97 6.35,13.97 6.35,0 99.06,0 arc90 101.6,2.54 101.6,78.74 arc90 99.06,81.28
  pour Top (isolate 0.5): 0,78.74 0,13.97 6.35,13.97 6.35,12.57 13.84,12.57 13.84,2.67 6.35,2.67 6.35,0 99.06,0 arc90 101.6,2.54 101.6,78.74 arc90 99.06,81.28 2.54,81.28 arc90
GPIO_9
  Top 0.5: GPIO2.1 26.12,53.34 26.43,53.03 26.43,49.2 28.08,47.55 μC.9
GPIO_11
  Top 0.5: GPIO2.2 24.64,50.8 25.4,50.04 25.4,47.5 25.95,46.95 26.48,46.95 μC.11
GPIO_26
  Top 0.5: μC.26 28.88,33.19 25.34,29.64 25.34,25.38 36.74,13.97 GPIO1.1
GPIO_27
  Top 0.5: GPIO1.2 40.28,14.88 37.23,14.88 26.35,25.77 26.35,29.48 29.68,32.81 μC.27
GPIO_32
  Top 0.5: μC.32 33.68,33.98 34.89,32.78 37.46,32.78 39.82,30.41 39.82,20.25 41.02,19.05 GPIO1.3
I2C_SCL  (via drill 0.35)
  Top 0.5: μC.44 37.17,44.64 38.31,45.78 41.66,45.78 41.66,40.48 42.53,39.61 | IMU_2.4 44.43,39.35 42.78,39.35 42.53,39.61 | 42.53,39.61 42.52,39.6 42.52,36.35 43.33,35.54 46.35,35.54 v46.38,35.56 46.38,37.47 52.98,44.07 55.04,44.07 55.87,43.24 58.31,43.24 59.64,41.91 OLED.3
  Bottom 0.5: v46.38,35.56 47.18,35.56 R10.2
I2C_SDA  (via drill 0.35)
  Top 0.5: IMU_2.5 46.5,38.88 v46.5,38.91 | v46.5,38.91 46.5,39.86 45.72,40.64 42.42,40.64 42.42,47.5 34.48,47.5 μC.1 | OLED.4 59.64,44.45 58.43,45.66 55.61,45.66 55.04,45.09 52.55,45.09 46.5,39.03 v46.5,38.91
  Bottom 0.5: v46.5,38.91 46.93,38.48 R11.2
IMU_INT
  Top 0.5: μC.43 37.42,43.84 38.57,44.98 40.77,44.98 40.77,40.19 41.62,39.34 41.62,35.98 43.31,34.29 IMU_2.6
LED1  (via drill 0.35)
  Top 0.5: v48.77,25.53 54.48,25.53 58.96,21.05 58.96,19.56 LED1.C | μC.33 34.48,34.23 35.18,33.53 37.72,33.53 40.64,30.61 40.64,27.69 42.8,25.53 v43.18,25.53
  Bottom 0.5: v48.77,25.53 v43.18,25.53
LED2  (via drill 0.35)
  Top 0.5: v48.77,26.67 54.61,26.67 59.81,21.47 59.81,17.41 59.42,17.02 LED2.C | μC.34 37.02,36.64 37.47,36.2 37.47,34.83 41.42,30.88 41.42,28.43 v43.18,26.67
  Bottom 0.5: v48.77,26.67 v43.18,26.67
LED3  (via drill 0.35)
  Top 0.5: v48.77,27.94 54.64,27.94 60.69,21.89 60.69,16.13 59.42,14.86 LED3.C | v43.18,27.94 42.2,28.92 42.2,31.15 38.37,34.98 38.37,36.59 37.54,37.42 36.3,37.42 μC.35
  Bottom 0.5: v48.77,27.94 v43.18,27.94
LED4  (via drill 0.35)
  Top 0.5: μC.36 36.3,38.22 37.92,38.22 39.18,36.97 39.18,35.18 43.05,31.3 43.05,29.34 v43.18,29.21 | v48.77,29.21 48.78,29.23 54.53,29.23 61.57,22.19 61.57,14.85 59.42,12.7 LED4.C
  Bottom 0.5: v43.18,29.21 v48.77,29.21
LED5  (via drill 0.35)
  Top 0.5: v28.32,54.23 28.32,54.19 27.2,53.06 27.2,49.44 28.88,47.75 μC.8 | LED5.C 33.53,56.9 v32.26,58.17
  Bottom 0.5: v32.26,58.17 v28.32,54.23
M_STDBY
  Top 0.45: 19.84,38.99 17.65,38.99 16.96,38.3 15.25,38.3 14.74,37.79 MOTOR_CTL.19
  Top 0.5: μC.15 24.6,42.16 21.36,42.16 20.64,41.44 20.64,39.79 19.84,38.99
MA_DIR1
  Top 0.45: MOTOR_CTL.21 14.1,39.09 15.37,40.36 18.54,40.36
  Top 0.5: μC.13 22.02,43.84 18.54,40.36
MA_DIR2
  Top 0.45: MOTOR_CTL.22 13.72,39.74 14.99,41.01 18.03,41.01
  Top 0.5: μC.12 21.66,44.64 18.03,41.01
MA_ENC_A  (via drill 0.35)
  Top 0.5: μC.4 32.08,55.55 29.21,58.42 v23.62,58.42 | MOTOR_A.6 11.43,58.42 v17.14,58.42
  Bottom 0.5: v17.14,58.42 v23.62,58.42
MA_ENC_B  (via drill 0.35)
  Top 0.5: MOTOR_A.5 12.7,57.15 v17.14,57.15 | μC.5 31.28,55.08 29.21,57.15 v23.62,57.15
  Bottom 0.5: v17.14,57.15 v23.62,57.15
MA_OUT1
  Top 1.5: MOTOR_CTL.2 arc0 MOTOR_CTL.1 5.33,41.39
  Top 2: MOTOR_A.2 5.33,47.24 5.33,41.39
MA_OUT2
  Top 0.45: MOTOR_CTL.5 7.53,38.44 7.62,38.35 | 6.8,37.79 MOTOR_CTL.6 5.64,38.1 7.11,38.1 | 7.62,38.23 7.24,38.23
  Top 0.508: 6.8,37.79 7.11,38.1 7.24,38.23
  Top 1.5: MOTOR_CTL.5 arc0 MOTOR_CTL.6
  Top 2: MOTOR_A.1 10.16,48.39 7.62,45.85 7.62,38.35 7.62,38.23
MA_PWM  (via drill 0.35)
  Top 0.45: MOTOR_CTL.23 13.4,40.39 14.74,41.74 16.34,41.74 v16.38,41.78
  Top 0.5: v26.16,48.01 26.54,48.01 27.28,47.27 μC.10
  Bottom 0.5: v26.16,48.01 23.24,48.01 17.02,41.78 v16.38,41.78
MB_DIR1
  Top 0.45: 20.28,38.35 18.12,38.35 16,36.24 14.1,36.24 13.85,36.49 MOTOR_CTL.17
  Top 0.5: μC.19 20.96,39.04 20.28,38.35
MB_DIR2
  Top 0.45: 20.68,37.58 18.44,37.58 16.45,35.59 13.85,35.59 13.6,35.84 MOTOR_CTL.16
  Top 0.5: μC.20 21.34,38.24 20.68,37.58
MB_ENC_A
  Top 0.5: MOTOR_B.5 10.16,27.18 18.97,35.98 21.1,35.98 21.76,36.64 μC.22
MB_ENC_B
  Top 0.5: MOTOR_B.6 7.62,25.78 18.64,36.8 20.87,36.8 21.5,37.44 μC.21
MB_OUT1  (via drill 1)
  Top 1.5: MOTOR_CTL.12 arc0 MOTOR_CTL.11
  Top 1.7: v4.45,32 v4.44,32.01
  Top 1.8: MOTOR_CTL.12 4.44,33
  Top 2: 4.44,33 v4.44,32.01
  Bottom 2: v4.45,32 4.19,31.75 4.19,17.91 10.16,17.91 MOTOR_B.1
MB_OUT2
  Top 0.45: 2.41,36.49 2.09,36.49 1.58,36.49 2.23,37.14 MOTOR_CTL.7 4.95,36.76 2.68,36.76 2.41,36.49 | 2.41,36.49 MOTOR_CTL.8
  Top 1.5: MOTOR_CTL.8 arc0 MOTOR_CTL.7
  Top 2: MOTOR_B.2 3.5,20.32 2.09,21.73 2.09,36.49
MB_PWM  (via drill 0.35)
  Top 0.45: v13.97,34.8 13.73,34.8 13.34,35.19 MOTOR_CTL.15
  Top 0.5: μC.14 22.88,43.04 v22.86,43.06
  Bottom 0.5: v22.86,43.06 19.56,43.06 17.4,40.9 16.77,40.9 15.49,39.62 15.49,36.83 13.97,35.31 v13.97,34.8
MCLR  (via drill 0.35)
  Top 0.5: µC_RST.4 72.1,30.19 73.79,31.88 76.45,31.88 | µC_RST.2 72.31,18.1 | μC.18 22.64,39.84 v22.61,39.88 | UC_PROG.1 96.52,52.32 89.53,45.34 89.53,35.81 85.6,31.88 76.45,31.88 | 76.45,31.88 76.45,41.4 70.48,47.37 63.25,47.37 61.85,48.77 v36.45,48.77
  Top 1: 72.31,18.1 R12.1 | µC_RST.4 µC_RST.2
  Bottom 0.5: v36.45,48.77 36.45,46.61 29.72,39.88 v22.61,39.88
N$1
  Top 0.5: BT_CON.C 18.13,5.3 R9.2
N$2
  Top 2: BAT.+ 11.26,74.55 POWER_SW.3
N$3
  Top 1: R4.2 LED1.A
N$4
  Top 1: R1.2 7.4V.A
N$5  (via drill 0.35)
  Top 0.5: μC.17 22.9,40.64 22.77,40.77 21.59,40.77 v21.46,40.64
  Bottom 1: 21.72,36.64 21.72,38.67 C11.2 21.52,39.62 21.52,40.58 v21.46,40.64 | 21.72,36.64 L1.1 | C12.2 21.72,36.64
N$6
  Top 1: S1.4 72.1,59.69 | R13.1 C23.1 72.42,59.37 72.1,59.69 | 72.1,59.69 S1.2 72.52,54.29 R14.1
N$7
  Top 0.5: 76.07,23.87 D1.1
  Top 1: 76.07,23.87 R12.2
N$8
  Top 1: R5.2 LED2.A
N$9  (via drill 0.35)
  other vias: 31.75,66.04
N$10  (via drill 0.35)
  other vias: 31.75,64.77
N$11  (via drill 0.35)
  other vias: 31.75,63.5
N$12  (via drill 0.35)
  other vias: 33.02,63.5
N$13  (via drill 0.35)
  other vias: 33.02,64.77
N$14  (via drill 0.35)
  other vias: 33.02,66.04
N$15  (via drill 0.35)
  other vias: 34.29,66.04
N$16
  Top 1: R2.2 5V.A
N$17
  Top 1: R3.2 3.3V.A
N$18  (via drill 0.35)
  other vias: 34.29,64.77
N$19  (via drill 0.35)
  other vias: 34.29,63.5
N$20  (via drill 0.35)
  other vias: 35.56,66.04
N$21  (via drill 0.35)
  other vias: 35.56,64.77
N$22  (via drill 0.35)
  other vias: 35.56,63.5
N$23  (via drill 0.35)
  other vias: 53.34,66.04
N$24  (via drill 0.35)
  other vias: 54.61,66.04
N$25  (via drill 0.35)
  other vias: 55.88,66.04
N$26  (via drill 0.35)
  other vias: 57.15,66.04
N$27  (via drill 0.35)
  other vias: 57.15,64.77
N$28  (via drill 0.35)
  other vias: 55.88,64.77
N$29  (via drill 0.35)
  other vias: 54.61,64.77
N$30  (via drill 0.35)
  other vias: 53.34,64.77
N$31  (via drill 0.35)
  other vias: 53.34,63.5
N$32  (via drill 0.35)
  other vias: 54.61,63.5
N$33  (via drill 0.35)
  other vias: 55.88,63.5
N$34  (via drill 0.35)
  other vias: 57.15,63.5
N$35  (via drill 0.35)
  other vias: 58.42,66.04
N$36  (via drill 0.35)
  other vias: 58.42,64.77
N$37  (via drill 0.35)
  other vias: 58.42,63.5
N$38  (via drill 0.35)
  other vias: 53.34,67.31
N$39  (via drill 0.35)
  other vias: 54.61,67.31
N$40  (via drill 0.35)
  other vias: 55.88,67.31
N$41  (via drill 0.35)
  other vias: 57.15,67.31
N$42  (via drill 0.35)
  other vias: 58.42,67.31
N$43  (via drill 0.35)
  other vias: 58.42,62.23
N$44  (via drill 0.35)
  other vias: 57.15,62.23
N$45  (via drill 0.35)
  other vias: 55.88,62.23
N$46  (via drill 0.35)
  other vias: 54.61,62.23
N$47  (via drill 0.35)
  other vias: 53.34,62.23
N$48  (via drill 0.35)
  other vias: 31.75,67.31
N$49  (via drill 0.35)
  other vias: 33.02,67.31
N$50  (via drill 0.35)
  other vias: 34.29,67.31
N$51  (via drill 0.35)
  other vias: 35.56,67.31
N$52  (via drill 0.35)
  other vias: 36.83,67.31
N$53  (via drill 0.35)
  other vias: 36.83,66.04
N$54  (via drill 0.35)
  other vias: 36.83,64.77
N$55  (via drill 0.35)
  other vias: 36.83,63.5
N$56  (via drill 0.35)
  other vias: 36.83,62.23
N$57  (via drill 0.35)
  other vias: 35.56,62.23
N$58  (via drill 0.35)
  other vias: 34.29,62.23
N$59  (via drill 0.35)
  other vias: 33.02,62.23
N$60  (via drill 0.35)
  other vias: 31.75,62.23
N$61
  Top 1: LED3.A R6.2
N$62
  Top 1: R7.2 LED4.A
N$63
  Top 1: R8.2 LED5.A
OSC1
  Top 0.5: μC.30 32.08,32.33 31.62,31.88 31.62,29.72 Q1.1 30.42,28.51 C16.1
OSC2
  Top 0.5: C17.1 36.64,28.51 Q1.2 35.94,29.72 32.88,32.78 μC.31
PG_EC3  (via drill 0.35)
  Top 0.5: UC_PROG.5 88.01,64.77 83.67,60.43 83.67,53.24 80.73,50.29 64.52,50.29 62.99,51.82 v37.97,51.82 | μC.42 36.3,43.06 v37.64,43.06
  Bottom 0.5: v37.97,51.82 37.95,51.8 37.95,43.38 v37.64,43.06
PG_ED3  (via drill 0.35)
  Top 0.5: UC_PROG.4 95,63.75 88.52,63.75 84.71,59.94 84.71,52.7 81.28,49.28 64.14,49.28 62.61,50.8 v38.86,50.8 | μC.41 37.92,42.24 38.73,43.05 v38.73,43.43
  Bottom 0.5: v38.86,50.8 38.86,43.56 v38.73,43.43
SENS_DIST_1  (via drill 0.35)
  Top 0.5: SENS_DIST_1.3 92.96,76.2 99.06,70.1 99.06,15.75 94.87,11.56 67.6,11.56 64.91,8.87 52.21,8.87 v52.2,8.89 | v41.53,8.89 39.24,8.89 23.47,24.66 23.47,29.89 27.28,33.7 μC.24
  Bottom 0.5: v52.2,8.89 v41.53,8.89
SENS_DIST_2  (via drill 0.35)
  Top 0.5: SENS_DIST_2.3 97.79,36.83 97.79,16.51 93.98,12.7 67.18,12.7 64.64,10.16 v52.2,10.16 | μC.25 28.08,33.44 24.4,29.76 24.4,25.01 39.24,10.16 v41.53,10.16
  Bottom 0.5: v52.2,10.16 v41.53,10.16
SENS_DIST_3  (via drill 0.35)
  Top 0.5: SENS_DIST_3.3 85.09,6.35 80.9,10.54 68.14,10.54 65.18,7.58 52.23,7.58 v52.2,7.62 | v41.53,7.62 39.24,7.62 22.61,24.26 22.61,30.08 26.48,33.95 μC.23
  Bottom 0.5: v52.2,7.62 v41.53,7.62
UART_BT_RX
  Top 0.5: UART_BT.8 14.06,7.02 15.37,5.71 15.37,3.94 16.89,2.41 39.88,2.41 48.26,10.79 RX_SEL.1
UART_DBG_RX
  Top 0.5: RX_SEL.3 47.3,20.01 47.3,29.75 48.99,31.43 56.07,31.43 60.69,26.81 60.69,25.46 62.53,23.62 UART.1
UART_RX
  Top 0.5: RX_SEL.2 46.74,16.51 45.17,18.08 45.17,30.24 39.95,35.45 39.95,37.39 38.3,39.04 μC.37
UART_TX
  Top 0.5: UART_BT.7 13.87,5.82 14.46,5.22 14.46,3.29 16.3,1.44 40.43,1.44 50.29,11.3 50.29,17.14 49.67,17.76 47.02,17.76 46.21,18.57 46.21,29.99 46.33,30.12 | μC.38 38.83,39.84 40.73,37.93 40.73,35.72 46.33,30.12 | 46.33,30.12 48.6,32.38 56.52,32.38 UART.2
VCAP/VDDCORE
  Top 0.5: μC.7 29.68,48.09 28.83,48.94 C13.2

### Text on the board
tNames: X | Y | Z | Kai H. / Ági B. / Jázmin D. / Paulo S.
bNames: 5V | GND | OUT | EC | ED | GND | 3V3 | MCLR | RP11 | RP13 | 3V3 | SDA | 5V | GND | SCL | GND | SCL | GND | 3V3 | OUT | SDA | GND | INT | 3V3 | GND | TX | RX | RA8 | PHY_RX | RP18 | uC_RX | RP17 | BT_RX | OUT | GND | 5V